# Altium schematic sheet BMI088.SchDoc: OMAV_OrinNX_A603_Board
size A4; Date: 27.02.2025; ApprovedBy: Lennert Matthias Maurer; CheckedBy: Lennert Matthias Maurer; Author: Lennert Matthias Maurer; CompanyName: ETH Zürich; DrawnBy: Lennert Matthias Maurer; Engineer: Lennert Matthias Maurer; Organization: ETH Zürich; Address1: Autonomous Systems Lab; Address2: Leonhardstrasse 21; Address3: 8092 Zurich; Address4: Swizerland; DocumentNumber: 2; Revision: 0; SheetNumber: 2; SheetTotal: 2; Time: 18:55; ImagePath: no entry; Application_BuildNumber: no entry
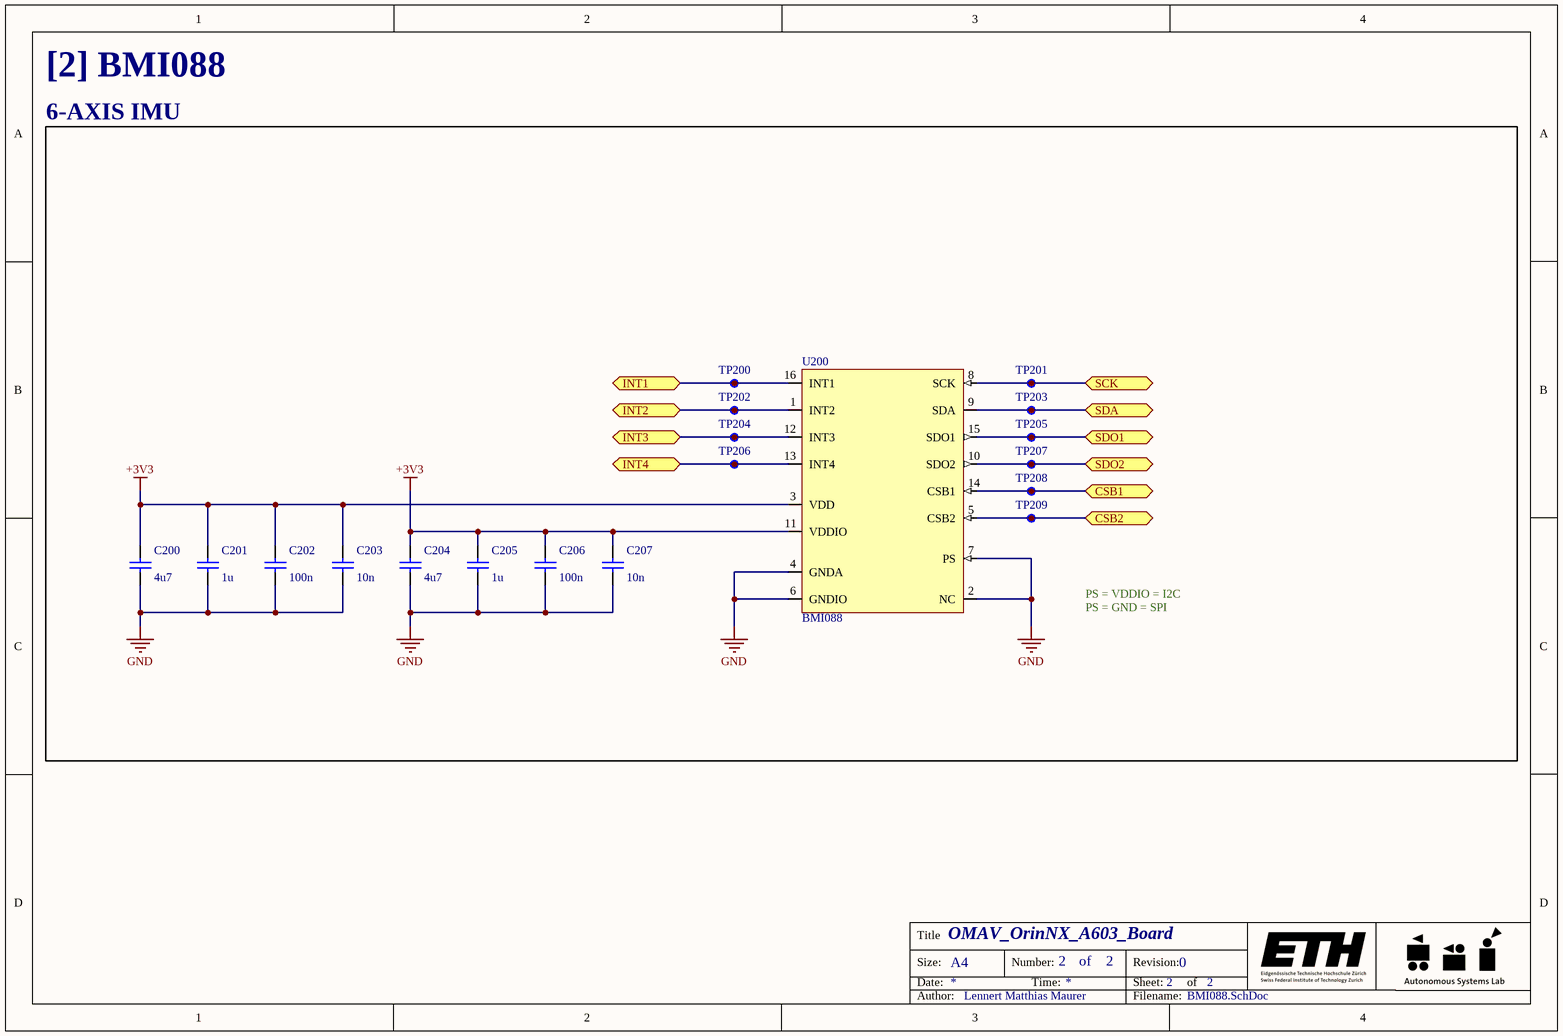
[diagram p0: BMI088.SchDoc]

## Parts
C200  value 4u7  [SMD_CAPC2012X12N]  (hidden comment: C0603)
C201  value 1u  [SMD_CAPC2012X12N]  (hidden comment: C0603)
C202  value 100n  [SMD_CAPC2012X12N]  (hidden comment: C0603)
C203  value 10n  [SMD_CAPC2012X12N]  (hidden comment: C0603)
C204  value 4u7  [SMD_CAPC2012X12N]  (hidden comment: C0603)
C205  value 1u  [SMD_CAPC2012X12N]  (hidden comment: C0603)
C206  value 100n  [SMD_CAPC2012X12N]  (hidden comment: C0603)
C207  value 10n  [SMD_CAPC2012X12N]  (hidden comment: C0603)
TP200  Test Point Small  [SMD_PAD_0.5mm]  (value not drawn)  (no BOM)
TP201  Test Point Small  [SMD_PAD_0.5mm]  (value not drawn)  (no BOM)
TP202  Test Point Small  [SMD_PAD_0.5mm]  (value not drawn)  (no BOM)
TP203  Test Point Small  [SMD_PAD_0.5mm]  (value not drawn)  (no BOM)
TP204  Test Point Small  [SMD_PAD_0.5mm]  (value not drawn)  (no BOM)
TP205  Test Point Small  [SMD_PAD_0.5mm]  (value not drawn)  (no BOM)
TP206  Test Point Small  [SMD_PAD_0.5mm]  (value not drawn)  (no BOM)
TP207  Test Point Small  [SMD_PAD_0.5mm]  (value not drawn)  (no BOM)
TP208  Test Point Small  [SMD_PAD_0.5mm]  (value not drawn)  (no BOM)
TP209  Test Point Small  [SMD_PAD_0.5mm]  (value not drawn)  (no BOM)
U200  BMI088  [16LGA]

## Blocks framed on the sheet
6-AXIS IMU: C200-C207 TP200-TP209 U200

## Ports
CSB1 (bidir, see Overview[2A]), CSB2 (bidir, see Overview[2A]), INT1 (bidir, see Overview[2B]), INT2 (bidir, see Overview[2B]), INT3 (bidir, see Overview[2B]), INT4 (bidir, see Overview[2B]), SCK (bidir, see Overview[2B]), SDA (bidir, see Overview[2B]), SDO1 (bidir, see Overview[2A]), SDO2 (bidir, see Overview[2A])

## Nets
+3V3: C200.2 C201.2 C202.2 C203.2 C204.2 C205.2 C206.2 C207.2 U200.3(VDD) U200.11(VDDIO)
GND: C200.1 C201.1 C202.1 C203.1 C204.1 C205.1 C206.1 C207.1 U200.2(NC) U200.4(GNDA) U200.6(GNDIO) U200.7(PS)
CSB1: TP208.1 U200.14(CSB1) ; port CSB1
CSB2: TP209.1 U200.5(CSB2) ; port CSB2
INT1: TP200.1 U200.16(INT1) ; port INT1
INT2: TP202.1 U200.1(INT2) ; port INT2
INT3: TP204.1 U200.12(INT3) ; port INT3
INT4: TP206.1 U200.13(INT4) ; port INT4
SCK: TP201.1 U200.8(SCK) ; port SCK
SDA: TP203.1 U200.9(SDA) ; port SDA
SDO1: TP205.1 U200.15(SDO1) ; port SDO1
SDO2: TP207.1 U200.10(SDO2) ; port SDO2

## Notes on the sheet
- [2] BMI088
- PS = VDDIO = I2C
  PS = GND = SPI
- Title
- Size:
- Date:
- A4
- Number:
- Time:
- of
- Revision:
- Sheet:
- Author:
- Filename:

## Library data of the parts
C200 C204 = CMP-02803-1: CERCAP 4u7 35V 10% X5R 0603; Manufacturer: Murata; Manufacturer Part Number: GRM188R6YA475KE15D; Supplier: Digi-Key; Supplier Part Number: 490-7205-1-ND
C201 C205 = CMP-02803-1: CERCAP 1u 50V 10% X5R 0603; Manufacturer: Murata; Manufacturer Part Number: GRT188R61H105KE13D; Supplier: Digi-Key; Supplier Part Number: 490-12330-1-ND
C202 C206 = CMP-02803-1: CERCAP 100n 100V 10% X7R 0603; Manufacturer: Murata; Manufacturer Part Number: GRM188R72A104KA35D; Supplier: Digi-Key; Supplier Part Number: 490-3285-1-ND
C203 C207 = CMP-02803-1: CERCAP 10n 100V 10% X7R 0603; Manufacturer: Murata; Manufacturer Part Number: GCM188R72A103KA37D; Supplier: Digi-Key; Supplier Part Number: 490-4781-1-ND
TP200-TP209 = CMP-02902-6: TP TESTPOINT MULTIPLE_SIZE
U200 = CMP-03360-1: SENSOR IMU 2.4-3.6V 16LGA; Manufacturer: Bosch Sensortec; Manufacturer Part Number: BMI088; Supplier: Digi-Key; Supplier Part Number: 828-1082-1-ND; Supplier2: Mouser; Supplier2 Part Number: 262-BMI088